# Altium schematic sheet CH32V20x_WUI_DEMO.schdoc
size 274 x 243 mm; Symbol: Sheet-Symbol_A4; Company: Caesar; Drawed: Caesar; Reviewed: Caesar; Version: V1.0; Page Size: A4; @Project Name: CH32X035G8U6_Multifunctional_Keyboard-1v3-20240412; @Page Count: 1; @Update Date: 2024-04-12; @Create Date: 2024-03-18; @Schematic Name: Schematic1; @Page No: 1; @Page Name: P1; Device: Sheet-Symbol_A4; SheetNumber: 1; SheetTotal: 1
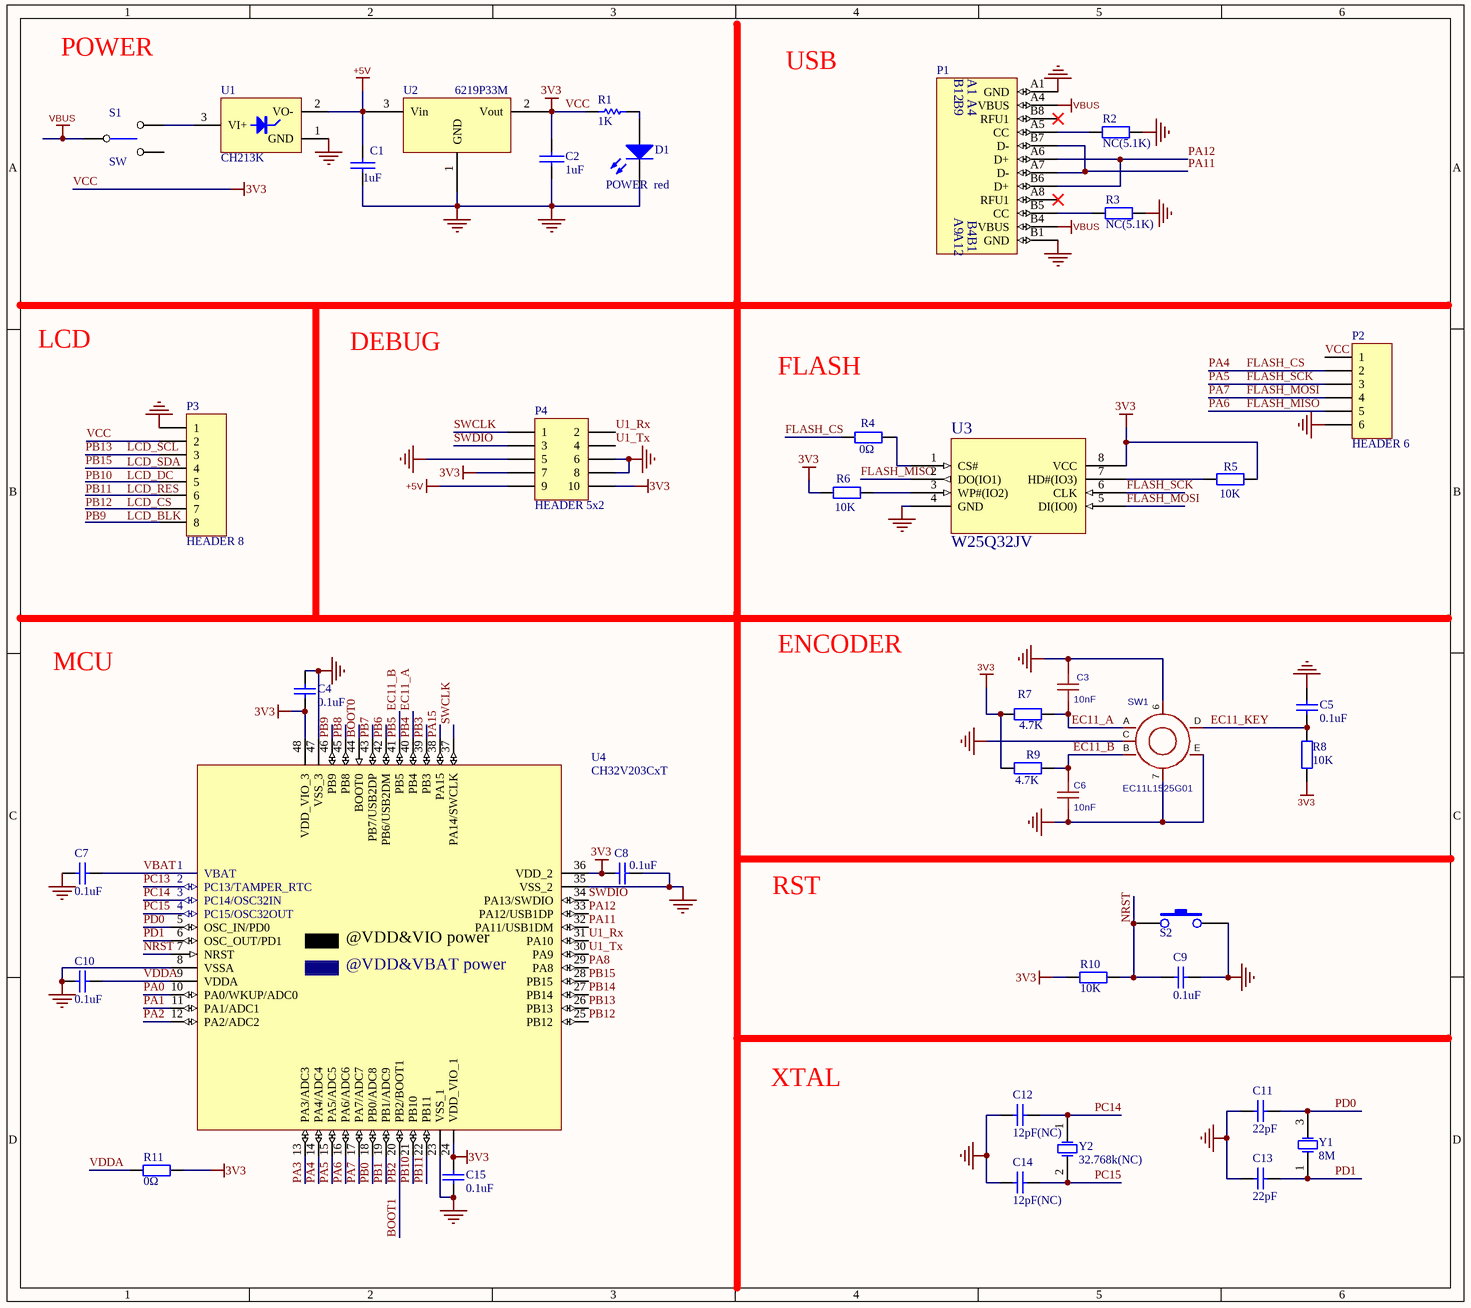
[diagram p0: CH32V20x_WUI_DEMO.schdoc]

## Parts
C1  1uF  [0402_C]
C2  1uF  [0402_C]
C3  10nF  [0402_C]
C4  0.1uF  [0402_C]
C5  0.1uF  [0402_C]
C6  10nF  [0402_C]
C7  0.1uF  [0402_C]
C8  0.1uF  [0402_C]
C9  0.1uF  [0402_C]
C10  0.1uF  [0402_C]
C11  22pF  [0402_C]
C12  12pF(NC)  [0402_C]
C13  22pF  [0402_C]
C14  12pF(NC)  [0402_C]
C15  0.1uF  [0402_C]
D1  POWER  red  [0603+]
P1  TYPE-C  [TYPE-C-Receptacle-2.0]  (value not drawn)
P2  HEADER 6  [SIP6-2.54mm]
P3  HEADER 8  [SIP8-2.54mm]
P4  HEADER 5x2  [IDC10-2.54mm]
R1  1K  [0402]
R2  NC(5.1K)  [0402]
R3  NC(5.1K)  [0402]
R4  0Ω  [0402]
R5  10K  [0402]
R6  10K  [0402]
R7  4.7K  [0402]
R8  10K  [0402]
R9  4.7K  [0402]
R10  10K  [0402]
R11  0Ω  [0402]
S1  SW  [SW1]
S2  KEY  [贴片按键]  (value not drawn)
SW1  EC11L1525G01  [SW-TH_ALPS_EC11L1525G01]
U1  CH213K  [SOT-23-3]
U2  6219P33M  [SOT-23]
U3  W25Q32JV  [SOIC-8_208mil]
U4  CH32V203CxT  [LQFP48]
Y1  8M  [XT3225]
Y2  32.768k(NC)  [FC-135]

## Nets
+5V: C1.1 P4.9 U1.2(VO-) U2.3(Vin)
GND: C1.2 C2.2 C3.2 C4.1 C5.1 C6.2 C7.2 C8.1 C9.1 C10.2 C11.1 C12.2 C13.1 C14.2 C15.1 D1.2(K) P1.A1(GND) P1.B1(GND) P2.6 P3.1 P4.5 P4.6 P4.8 R2.2 R3.2 S2.2 SW1.6(EH) SW1.7(EH) SW1.C SW1.E U1.1(GND) U2.1(GND) U3.4(GND) U4.8(VSSA) U4.23(VSS_1) U4.35(VSS_2) U4.47(VSS_3)
VBUS: P1.A4(VBUS) P1.B4(VBUS) S1.1
VCC: C2.1 C4.2 C8.2 C15.2 P2.1 P3.2 P4.7 P4.10 R1.2 R5.2 R6.1 R7.1 R8.1 R9.1 R10.2 R11.1 U2.2(Vout) U3.8(VCC) U4.24(VDD_VIO_1) U4.36(VDD_2) U4.48(VDD_VIO_3)  [also labelled 3V3]
BOOT0: U4.44(BOOT0)
BOOT1: U4.20(PB2/BOOT1)  [also labelled PB2]
EC11_A: C3.1 R7.2 SW1.A U4.40(PB4)  [also labelled PB4]
EC11_B: C6.1 R9.2 SW1.B U4.41(PB5)  [also labelled PB5]
EC11_KEY: C5.2 R8.2 SW1.D
FLASH_CS: P2.2 R4.1 U4.14(PA4/ADC4)  [also labelled PA4]
FLASH_MISO: P2.5 U3.2(DO(IO1)) U4.16(PA6/ADC6)  [also labelled PA6]
FLASH_MOSI: P2.4 U3.5(DI(IO0)) U4.17(PA7/ADC7)  [also labelled PA7]
FLASH_SCK: P2.3 U3.6(CLK) U4.15(PA5/ADC5)  [also labelled PA5]
LCD_SCL: P3.3 U4.26(PB13)  [also labelled PB13]
NRST: C9.2 R10.1 S2.1 U4.7(NRST)
PA0: U4.10(PA0/WKUP/ADC0)
PA1: U4.11(PA1/ADC1)
PA2: U4.12(PA2/ADC2)
PA3: U4.13(PA3/ADC3)
PA8: U4.29(PA8)
PA11: P1.A7(D-) P1.B7(D-) U4.32(PA11/USB1DM)
PA12: P1.A6(D+) P1.B6(D+) U4.33(PA12/USB1DP)
PA15: U4.38(PA15)
PB0: U4.18(PB0/ADC8)
PB1: U4.19(PB1/ADC9)
PB3: U4.39(PB3)
PB6: U4.42(PB6/USB2DM)
PB7: U4.43(PB7/USB2DP)
PB8: U4.45(PB8)
PB9: U4.46(PB9)
PB10: U4.21(PB10)
PB11: U4.22(PB11)
PB12: U4.25(PB12)
PB14: U4.27(PB14)
PB15: P3.4 U4.28(PB15)
PC13: U4.2(PC13/TAMPER_RTC)
PC14: C12.1 U4.3(PC14/OSC32IN) Y2.1(OSC1)
PC15: C14.1 U4.4(PC15/OSC32OUT) Y2.2(OSC2)
PD0: C11.2 U4.5(OSC_IN/PD0) Y1.3(OSC2)
PD1: C13.2 U4.6(OSC_OUT/PD1) Y1.1(OSC1)
SWCLK: P4.1 U4.37(PA14/SWCLK)
SWDIO: P4.3 U4.34(PA13/SWDIO)
U1_Rx: P4.2 U4.31(PA10)
U1_Tx: P4.4 U4.30(PA9)
VBAT: C7.1 U4.1(VBAT)
VDDA: C10.1 R11.2 U4.9(VDDA)
NetD1_1: D1.1(A) R1.1
NetP1_A5: P1.A5(CC) R2.1
NetP1_B5: P1.B5(CC) R3.1
NetR4_2: R4.2 U3.1(CS#)
NetR5_1: R5.1 U3.7(HD#(IO3))
NetR6_2: R6.2 U3.3(WP#(IO2))
NetS1_3: S1.3 U1.3(VI+)

Not connected (* = marked no-connect by the designer): P1 A8(RFU1)* B8(RFU1)*; P3 5 6 7 8; S1 2

## Notes on the sheet
- POWER
- USB
- LCD
- DEBUG
- FLASH
- ENCODER
- MCU
- RST
- XTAL
- Labels drawn without touching a wire or pin: LCD_BLK, LCD_CS, LCD_DC, LCD_RES, LCD_SDA, PB9, PB10, PB11, PB12
- 更新日期
- 2024-04-12
- 原理图
- 图页
- Schematic1
- P1
- 创建日期
- 物料编码
- 2024-03-18
- 审阅
- 绘制
- Caesar
- CH32X035G8U6_Multifunctional_Keyboard-1v3-20240412
- 版本
- V1.0
- 尺寸
- A4
- 页
- 1
- 共
- (in symbol CH32V203CxT) @VDD&VIO power; @VDD&VBAT power
- (in symbol TYPE-C1) B12; B9; A9; A12

## Library data of the parts
C1 C2 = CAP: Capacitor
C3 C6 = CAP_0603: ConvertToPcb: yes; SymbolName: CapAcitance; ModelId: ac125912035d415993ca9572d50418b1; ModelName: C0603_L1.6-W0.8-H0.8; ModelTransform: 62.992,31.496,0,0,0,0,0,0,0; Value: 10nF; Device: CAP_0603; AddInBom: yes; Supplier Footprint: 0603; FootprintName: C0603
C4 C5 C7-C15 = Cap: Capacitor; Published: 8-Jun-2000; LatestRevisionDate: 17-Jul-2002; LatestRevisionNote: Re-released for DXP Platform.; PackageReference: RAD-0.3; Publisher: Altium Limited
  C5 C9: Value: 0.1uF
D1 = LED0: Typical INFRARED GaAs LED; Published: 8-Jun-2000; LatestRevisionDate: 08-Jul-2005; LatestRevisionNote: Mech Layer 1 removed.; PackageReference: LED-0; Publisher: Altium Limited
P1 = TYPE-C1
P2 = HEADER 6: Header, 6-Pin
P3 = HEADER 8: Header, 8-Pin
P4 = HEADER 5x2: Header, 5-Pin, Dual row
R1 = Res Semi: Semiconductor Resistor; Published: 8-Jun-2000; LatestRevisionDate: 17-Jul-2002; LatestRevisionNote: Re-released for DXP Platform.; PackageReference: AXIAL-0.5; Publisher: Altium Limited; Value: 1K
R2 R3 R5 R6 R8 R10 R11 = Res2: Resistor
  R5 R6 R8 R10: Published: 8-Jun-2000; LatestRevisionDate: 17-Jul-2002; LatestRevisionNote: Re-released for DXP Platform.; PackageReference: AXIAL-0.4; Publisher: Altium Limited; Value: 10K
  R11: Published: 8-Jun-2000; LatestRevisionDate: 17-Jul-2002; LatestRevisionNote: Re-released for DXP Platform.; PackageReference: AXIAL-0.4; Publisher: Altium Limited
R4 R7 R9 = Res2: Resistor; Value: 10K; Published: 8-Jun-2000; LatestRevisionDate: 17-Jul-2002; LatestRevisionNote: Re-released for DXP Platform.; PackageReference: AXIAL-0.4; Publisher: Altium Limited
SW1 = EC11L1525G01: Manufacturer: ALPSALPINE(阿尔卑斯阿尔派); AddInBom: yes; ModelId: cf33b882906a4832899d48957bbfbd3a; ModelTransform: 515.67818,588.582,0,0,0,0,-0.003,0,-137.795; Symbol: EC11L1525G01; Device: EC11L1525G01; LCSC Part Name: EC11L1525G01; SupplierPart: C2991196; ManufacturerPart: EC11L1525G01; Supplier Footprint: 插件; JLCPCB Part Class: 扩展库; Datasheet: https://atta.szlcsc.com/upload/public/pdf/source/20220411/178C78D91D042177C355D008FA29ADBD.pdf; Supplier: LCSC; ConvertToPcb: yes; FootprintName: SW-TH_ALPS_EC11L1525G01; ModelName: SW-TH_ALPS_EC11L1525G01
U1 = CH213K: Ideal Diode 5V*1A
U4 = CH32V203CxT: RISC-V LMD-MCU, 144MHz, 2*USB FS, CAN
Y1 Y2 = XTAL: Crystal Oscillator; Published: 8-Jun-2000; LatestRevisionDate: 17-Jul-2002; LatestRevisionNote: Re-released for DXP Platform.; PackageReference: R38; Publisher: Altium Limited